# Altium project EMI_EMC_project.PrjPcb
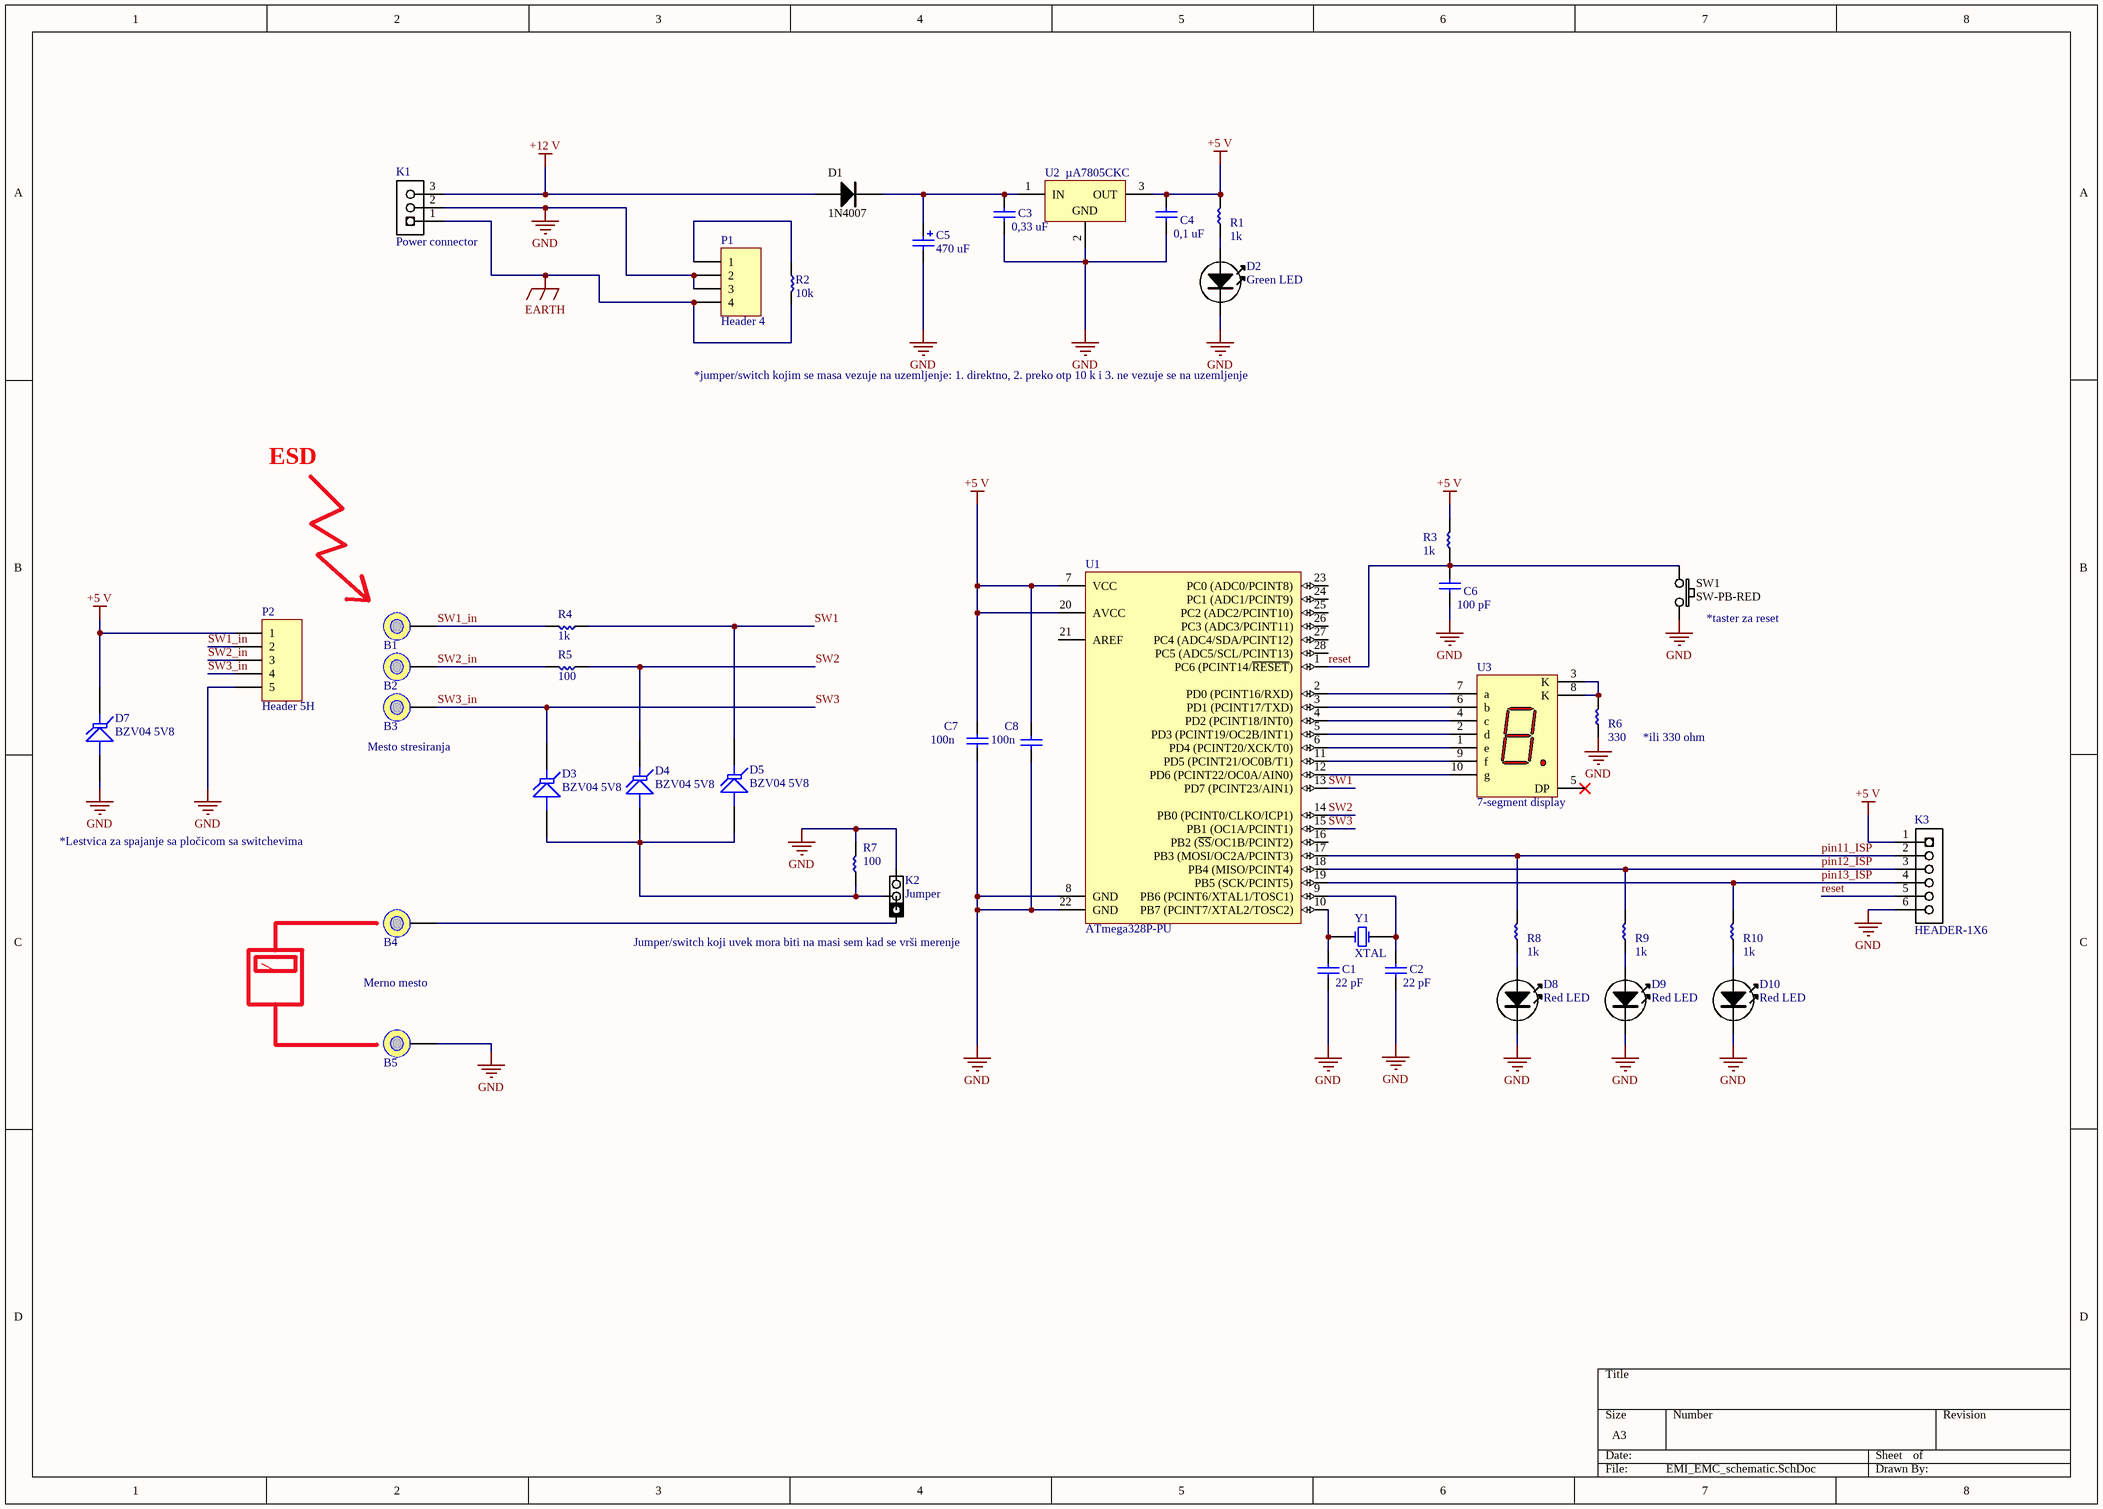
[diagram p0: EMI_EMC_schematic.SchDoc]
1 sheet, 42 parts. Net scope: global (net labels, ports and power ports of the same name join across sheets).
Board file: EMI_EMC_PCB1.PcbDoc

## Sheet EMI_EMC_schematic.SchDoc
size A3

### Parts
B1  Buksna 4mm  [Buksna 4mm]  (value not drawn)
B2  Buksna 4mm  [Buksna 4mm]  (value not drawn)
B3  Buksna 4mm  [Buksna 4mm]  (value not drawn)
B4  Buksna 4mm  [Buksna 4mm]  (value not drawn)
B5  Buksna 4mm  [Buksna 4mm]  (value not drawn)
C1  value 22 pF  [Cap_100mil]  (hidden comment: Cap)
C2  value 22 pF  [Cap_100mil]  (hidden comment: Cap)
C3  value 0,33 uF  [Cap_100mil]  (hidden comment: Cap)
C4  value 0,1 uF  [Cap_100mil]  (hidden comment: Cap)
C5  value 470 uF  [Cap Pol 1000 uF]  (hidden comment: Cap_pol)
C6  value 100 pF  [Cap_100mil]  (hidden comment: Cap)
C7  value 100n  [Cap_100mil]  (hidden comment: Cap)
C8  value 100n  [Cap_100mil]  (hidden comment: Cap)
D1  1N4007  [1N400X]
D2  Green LED  [LED-5MM-GREEN]
D3  Part name: BZV04 5V8  [TVS DO - 7]  (hidden comment: TVS diode)
D4  Part name: BZV04 5V8  [TVS DO - 7]  (hidden comment: TVS diode)
D5  Part name: BZV04 5V8  [TVS DO - 7]  (hidden comment: TVS diode)
D7  Part name: BZV04 5V8  [TVS DO - 7]  (hidden comment: TVS diode)
D8  Red LED  [LED-5MM-RED]
D9  Red LED  [LED-5MM-RED]
D10  Red LED  [LED-5MM-RED]
K1  Power connector  [Header for power]
K2  Jumper  [JMPR3-CLOSED-12]
K3  HEADER-1X6  [HEADER-1X6]
P1  Header 4  [HDR1X4]
P2  Header 5H  [HDR1X5H]
R1  value 1k  [Res_axial 0.4]  (hidden comment: res_0,25w)
R2  value 10k  [Res_axial 0.4]  (hidden comment: res_0,25w)
R3  value 1k  [Res_axial 0.4]  (hidden comment: res_0,25w)
R4  value 1k  [Res_axial 0.4]  (hidden comment: res_0,25w)
R5  value 100  [Res_axial 0.4]  (hidden comment: res_0,25w)
R6  value 330  [Res_axial 0.4]  (hidden comment: res_0,25w)
R7  value 100  [Res_axial 0.4]  (hidden comment: res_0,25w)
R8  value 1k  [Res_axial 0.4]  (hidden comment: res_0,25w)
R9  value 1k  [Res_axial 0.4]  (hidden comment: res_0,25w)
R10  value 1k  [Res_axial 0.4]  (hidden comment: res_0,25w)
SW1  SW-PB-RED  [SW-PB-RED-ROUND4]
U1  ATmega328P-PU  [28P3]
U2  µA7805CKC  [TO220]
U3  7-segment display  [7-segment disp]
Y1  XTAL  [xtal]

### Nets
+5 V: C4.1 C7.2 C8.2 D7.2(K) K3.1 P2.1 R1.2 R3.2 U1.7(VCC) U1.20(AVCC) U2.3(OUT)
+12 V: D1.A K1.3
EARTH: K1.1 P1.4 R2.2
GND: B5.1 C1.2 C2.2 C3.2 C4.2 C5.2 C6.2 C7.1 C8.1 D2.K D7.1(A) D8.K D9.K D10.K K1.2 K2.3 K3.6 P1.2 P1.3 P2.5 R6.1 R7.2 SW1.2 U1.8(GND) U1.22(GND) U2.2(GND)
pin11_ISP: K3.2 R8.2 U1.17(PB3_(MOSI/OC2A/PCINT3))
pin12_ISP: K3.3 R9.2 U1.18(PB4_(MISO/PCINT4))
pin13_ISP: K3.4 R10.2 U1.19(PB5_(SCK/PCINT5))
reset: C6.1 K3.5 R3.1 SW1.1 U1.1(PC6_(PCINT14/~{RESET}))
SW1: D5.2(K) R4.1 U1.13(PD7_(PCINT23/AIN1))
SW1_in: B1.1 P2.2 R4.2
SW2: D4.2(K) R5.1 U1.14(PB0_(PCINT0/CLKO/ICP1))
SW2_in: B2.1 P2.3 R5.2
SW3: B3.1 D3.2(K) P2.4 U1.15(PB1_(OC1A/PCINT1))  [also labelled SW3_in]
NetB4_1: B4.1 K2.1
NetC1_1: C1.1 U1.10(PB7_(PCINT7/XTAL2/TOSC2)) Y1.1(OSC1)
NetC2_1: C2.1 U1.9(PB6_(PCINT6/XTAL1/TOSC1)) Y1.2(OSC2)
NetC3_1: C3.1 C5.1 D1.K U2.1(IN)
NetD2_A: D2.A R1.1
NetD3_1: D3.1(A) D4.1(A) D5.1(A) K2.2 R7.1
NetD8_A: D8.A R8.1
NetD9_A: D9.A R9.1
NetD10_A: D10.A R10.1
NetP1_1: P1.1 R2.1
NetR6_2: R6.2 U3.3(K) U3.8(K)
NetU1_2: U1.2(PD0_(PCINT16/RXD)) U3.7(a)
NetU1_3: U1.3(PD1_(PCINT17/TXD)) U3.6(b)
NetU1_4: U1.4(PD2_(PCINT18/INT0)) U3.4(c)
NetU1_5: U1.5(PD3_(PCINT19/OC2B/INT1)) U3.2(d)
NetU1_6: U1.6(PD4_(PCINT20/XCK/T0)) U3.1(e)
NetU1_11: U1.11(PD5_(PCINT21/OC0B/T1)) U3.9(f)
NetU1_12: U1.12(PD6_(PCINT22/OC0A/AIN0)) U3.10(g)

Not connected (* = marked no-connect by the designer): B1 2; B2 2; B3 2; B4 2; B5 2; U1 16(PB2_(~{SS}/OC1B/PCINT2)) 21(AREF) 23(PC0_(ADC0/PCINT8)) 24(PC1_(ADC1/PCINT9)) 25(PC2_(ADC2/PCINT10)) 26(PC3_(ADC3/PCINT11)) 27(PC4_(ADC4/SDA/PCINT12)) 28(PC5_(ADC5/SCL/PCINT13)); U3 5(DP)*

### Notes on the sheet
- *jumper/switch kojim se masa vezuje na uzemljenje: 1. direktno, 2. preko otp 10 k i 3. ne vezuje se na uzemljenje
- ESD
- (near SW1) *taster za reset
- (near B3) Mesto stresiranja
- (near R6) *ili 330 ohm
- *Lestvica za spajanje sa pločicom sa switchevima
- Merno mesto
- (near K2) Jumper/switch koji uvek mora biti na masi sem kad se vrši merenje

### Library data of the parts
B1-B5 = Buksna
D1 = 1N4001
D2 = LED-GREEN-5MM
D8-D10 = LED-RED-5MM
K2 = JMPR3-12: JMPR3; Manufacturer: Sullins Connector Solutions; Manufacturer Part Number: PBC36SAAN; Reel: Closed 1-2; Supplier 1: Digi-Key; Supplier Part Number 1: S1011E-36-ND
P1 = Header 4: Header, 4-Pin; LatestRevisionDate: 17-Jul-2002; LatestRevisionNote: Re-released for DXP Platform.; Publisher: Altium Limited
P2 = Header 5H: Header, 5-Pin, Right Angle; LatestRevisionDate: 17-Jul-2002; LatestRevisionNote: Re-released for DXP Platform.; Publisher: Altium Limited
R1-R10 = Res_axial0.4
SW1 = SW-PB-RED: SW-D6-R / SW-DS-S / SW-14X14 / SW-7X7
U1 = ATmega328P-PU: 8-bit AVR Microcontroller, 32KB Flash, 1KB EEPROM, 2KB SRAM, 28-pin PDIP, Industrial Grade (-40°C to 85°C); Published: 1-Apr-2010; DatasheetVersion: revA, Jan-2010; PackageVersion: revB, Sep-2001; PackageReference: 28P3; Publisher: Altium Limited; PackageDescription: 28-lead (0.300"/7.62mm Wide) Plastic Dual Inline Package (PDIP); Supplier 1: Digi-Key; Supplier Part Number 1: ATMEGA328P-PU-ND; Supplier 2: Farnell; Supplier Part Number 2: 1715487; Supplier 3: Mouser; Supplier Part Number 3: 556-ATMEGA328P-PU; ComponentLink1Description: Manufacturer Link; ComponentLink1URL: http://www.atmel.com/products/avr/default.asp?; ComponentLink2Description: ATmega48A/48PA/88A/88PA/168A/168PA/328/328P Datasheet; ComponentLink2URL: http://www.atmel.com/dyn/resources/prod_documents/8271.pdf; ComponentLink3Description: ATmega48A/48PA/88A/88PA/168A/168PA/328/328P Summary; ComponentLink3URL: http://www.atmel.com/dyn/resources/prod_documents/8271S.pdf; ComponentLink4Description: Atmel.com Home; ComponentLink4URL: http://www.atmel.com
U2 = TO220
U3 = 7-segment
K3 = HEADER-1X6: Supplier 1: Digi-Key; Supplier Part Number 1: S1011E-36-ND